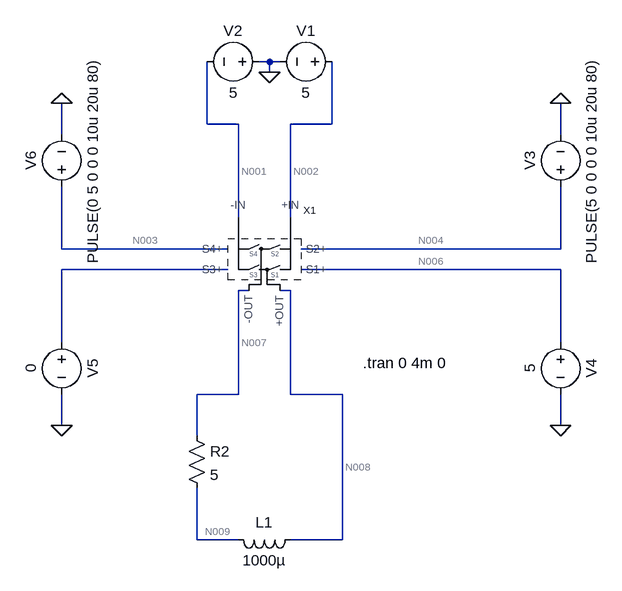
[diagram p0: schematic SPA_Test_Model.asc]
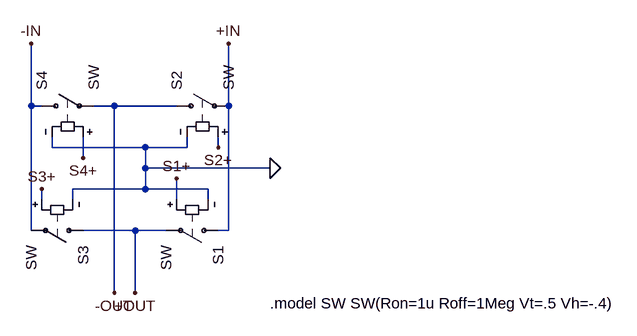
[diagram p1: sub-circuit h-bridge.asc]
SPA_Test_Model.asc, the LTspice schematic file:
Version 4
SHEET 1 2364 680
WIRE 192 -160 176 -160
WIRE 208 -160 192 -160
WIRE 192 -144 192 -160
WIRE 96 -64 96 -160
WIRE 144 -64 96 -64
WIRE 288 -64 288 -160
WIRE 288 -64 224 -64
WIRE -128 -48 -128 -96
WIRE 640 -48 640 -96
WIRE 144 80 144 -64
WIRE 224 80 224 -64
WIRE -128 128 -128 32
WIRE 128 128 -128 128
WIRE 640 128 640 32
WIRE 640 128 240 128
WIRE 128 160 -128 160
WIRE 640 160 240 160
WIRE 160 192 144 192
WIRE 224 192 208 192
WIRE -128 272 -128 160
WIRE 640 272 640 160
WIRE 144 352 144 192
WIRE 144 352 80 352
WIRE 224 352 224 192
WIRE 304 352 224 352
WIRE -128 400 -128 352
WIRE 640 400 640 352
WIRE 80 416 80 352
WIRE 80 576 80 496
WIRE 144 576 80 576
WIRE 304 576 304 352
WIRE 304 576 224 576
FLAG 640 400 0
FLAG 640 -96 0
FLAG -128 -96 0
FLAG -128 400 0
FLAG 192 -144 0
SYMBOL voltage 640 48 R180
WINDOW 0 32 56 VTop 2
WINDOW 3 -32 56 VBottom 2
WINDOW 123 0 0 Left 0
WINDOW 39 0 0 Left 0
SYMATTR InstName V3
SYMATTR Value PULSE(5 0 0 0 0 10u 20u 80)
SYMBOL H-Bridge 192 160 R0
SYMATTR InstName X1
SYMBOL res 64 400 R0
SYMATTR InstName R2
SYMATTR Value 5
SYMBOL ind 240 560 R90
WINDOW 0 5 56 VBottom 2
WINDOW 3 32 56 VTop 2
SYMATTR InstName L1
SYMATTR Value 1000µ
SYMBOL voltage 640 256 R0
WINDOW 0 32 56 VTop 2
WINDOW 3 -32 56 VBottom 2
WINDOW 123 0 0 Left 0
WINDOW 39 0 0 Left 0
SYMATTR InstName V4
SYMATTR Value 5
SYMBOL voltage -128 256 R0
WINDOW 0 32 56 VTop 2
WINDOW 3 -32 56 VBottom 2
WINDOW 123 0 0 Left 0
WINDOW 39 0 0 Left 0
SYMATTR InstName V5
SYMATTR Value 0
SYMBOL voltage -128 48 R180
WINDOW 0 32 56 VTop 2
WINDOW 3 -32 56 VBottom 2
WINDOW 123 0 0 Left 0
WINDOW 39 0 0 Left 0
SYMATTR InstName V6
SYMATTR Value PULSE(0 5 0 0 0 10u 20u 80)
SYMBOL voltage 304 -160 R90
WINDOW 0 -32 56 VBottom 2
WINDOW 3 32 56 VTop 2
WINDOW 123 0 0 Left 0
WINDOW 39 0 0 Left 0
SYMATTR InstName V1
SYMATTR Value 5
SYMBOL voltage 192 -160 R90
WINDOW 0 -32 56 VBottom 2
WINDOW 3 32 56 VTop 2
WINDOW 123 0 0 Left 0
WINDOW 39 0 0 Left 0
SYMATTR InstName V2
SYMATTR Value 5
TEXT 336 304 Left 2 !.tran 0 4m 0

h-bridge.asc, the sub-circuit schematic file:
Version 4
SHEET 1 1012 680
WIRE 64 128 64 32
WIRE 80 128 64 128
WIRE 192 128 160 128
WIRE 288 128 192 128
WIRE 368 128 368 32
WIRE 96 192 96 176
WIRE 240 192 96 192
WIRE 304 192 304 176
WIRE 304 192 240 192
WIRE 352 192 352 176
WIRE 144 208 144 176
WIRE 240 224 240 192
WIRE 432 224 240 224
WIRE 240 256 240 224
WIRE 240 256 128 256
WIRE 336 256 240 256
WIRE 80 272 80 256
WIRE 128 272 128 256
WIRE 288 272 288 240
WIRE 336 272 336 256
WIRE 64 320 64 128
WIRE 224 320 144 320
WIRE 272 320 224 320
WIRE 368 320 368 128
WIRE 368 320 352 320
WIRE 192 416 192 128
WIRE 224 416 224 320
FLAG 224 416 +OUT
FLAG 192 416 -OUT
FLAG 64 32 -IN
FLAG 368 32 +IN
FLAG 432 224 0
FLAG 144 208 S4+
FLAG 80 256 S3+
FLAG 352 192 S2+
FLAG 288 240 S1+
SYMBOL sw 64 128 R270
SYMATTR InstName S4
SYMBOL sw 272 128 R270
SYMATTR InstName S2
SYMBOL sw 160 320 R90
SYMATTR InstName S3
SYMBOL sw 368 320 R90
SYMATTR InstName S1
TEXT 432 432 Left 2 !.model SW SW(Ron=1u Roff=1Meg Vt=.5 Vh=-.4)

The netlist it stands for:
* SPA_Test_Model.asc
V3 N004 0 PULSE(5 0 0 0 0 10u 20u 80)
XX1 N001 N002 N007 N008 N004 N006 N003 N005 h-bridge
R2 N007 N009 5
L1 N008 N009 1000µ
V4 N006 0 5
V5 N005 0 0
V6 N003 0 PULSE(0 5 0 0 0 10u 20u 80)
V1 N002 0 5
V2 0 N001 5

* block symbol definitions
.subckt h-bridge -IN +IN -OUT +OUT S2+ S1+ S4+ S3+
S4 -IN -OUT S4+ 0 SW
S2 -OUT +IN S2+ 0 SW
S3 +OUT -IN S3+ 0 SW
S1 +IN +OUT S1+ 0 SW
.model SW SW(Ron=1u Roff=1Meg Vt=.5 Vh=-.4)
.ends h-bridge

.tran 0 4m 0
.backanno
.end

* Results of the author's LTspice run, read from the files saved beside the schematic
* Operating Point, zero values left out:
*   V(n004) = 5 V
*   V(n001) = -5 V
*   V(n007) = 5 V
*   V(n002) = 5 V
*   V(n008) = 5 V
*   V(n006) = 5 V
*   V(n009) = 5 V
*   I(V1) = -20 µA
*   I(V2) = -20 µA
*   Ix(x1:-IN) = -20 µA
*   Ix(x1:+IN) = 20 µA
*   Ix(x1:-OUT) = 9.173 pA
*   Ix(x1:+OUT) = 9.173 pA
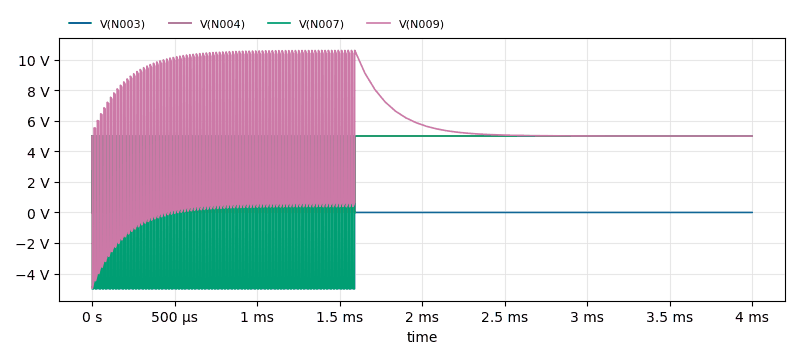
[diagram p2: Transient Analysis of SPA_Test_Model.asc, plotted from the saved traces]
* Transient Analysis, 1 run:
*   V(N003): min 0 V, max 5 V, average 1.1 V, rms 2.311 V, last 0 V
*   V(N004): min 0 V, max 5 V, average 3.9 V, rms 4.398 V, last 5 V
*   V(N007): min -5 V, max 5 V, average 2.803 V, rms 4.929 V, last 5 V
*   V(N009): min -4.977 V, max 10.61 V, average 5.003 V, rms 5.98 V, last 5 V